# Altium schematic sheet FAN.SchDoc
size A4
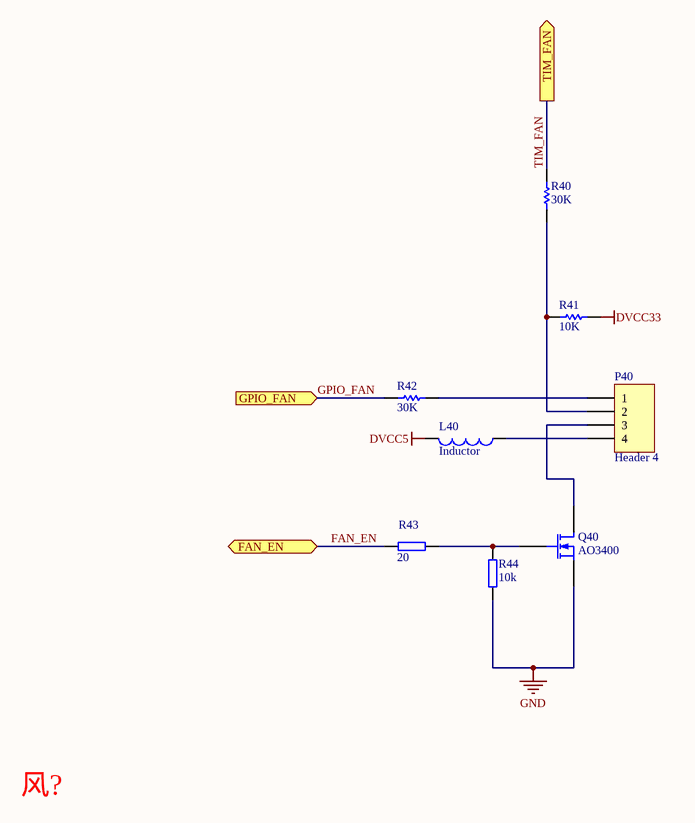
[diagram p0: FAN.SchDoc]

## Parts
L40  Inductor  [L0402]
P40  Header 4  [1.5P-4]
Q40  AO3400  [SI2300]
R40  30K  [R0402]
R41  10K  [R0402]
R42  30K  [R0402]
R43  20  [R0402]
R44  10k  [R0402]

## Ports
FAN_EN, GPIO_FAN (in), TIM_FAN (out)

## Nets
DVCC5: L40.2
DVCC33: R41.1
GND: Q40.3(S) R44.2
FAN_EN: R43.2 ; port FAN_EN
GPIO_FAN: R42.1 ; port GPIO_FAN
TIM_FAN: R40.2 ; port TIM_FAN
NetL40_1: L40.1 P40.4
NetP40_1: P40.1 R42.2
NetP40_2: P40.2 R40.1 R41.2
NetP40_3: P40.3 Q40.1(D)
NetQ40_2: Q40.2(G) R43.1 R44.1

## Notes on the sheet
- 风?

## Library data of the parts
L40 = Inductor: Code_IEC: 1005; Published: 8-Jun-2000; LatestRevisionDate: 29-May-2009; LatestRevisionNote: IPC-7351 Footprint Added.; PackageReference: 0402-A; Publisher: Altium Limited; PackageDescription: Chip Inductor; Code_JEITA: 0402
P40 = Header 4: Header, 4-Pin; LatestRevisionDate: 17-Jul-2002; LatestRevisionNote: Re-released for DXP Platform.; Publisher: Altium Limited
Q40 = MOSFET-N: N-Channel MOSFET; pin to pad: 1>3 2>1 3>2; ·: 贴片; 元件�: N-MOS; 产地: *; 厂商: *; 大小: *; 封装�: *; 型号: AO3400; 物料�: *
R40 R42 = R0402: Resistor 0402; Published: 8-Jun-2000; LatestRevisionDate: 17-Jul-2002; LatestRevisionNote: Re-released for DXP Platform.; PackageReference: AXIAL-0.3; Publisher: Altium Limited; PackageDescription: Axial Device, Thru-Hole; 2 Leads; 0.3 in Pin Spacing; Value: 30K
R41 = R0402: Resistor 0402; Value: 1K; Published: 8-Jun-2000; LatestRevisionDate: 17-Jul-2002; LatestRevisionNote: Re-released for DXP Platform.; PackageReference: AXIAL-0.3; Publisher: Altium Limited; PackageDescription: Axial Device, Thru-Hole; 2 Leads; 0.3 in Pin Spacing
R43 R44 = RES1: Ô: 电阻; 价格: 0.01; ·: 贴片; 封装�: 0603
  R43: 大小: 20
  R44: 大小: 10k